# Altium schematic sheet H.SchDoc
size A; SheetNumber: 1; SheetTotal: 7
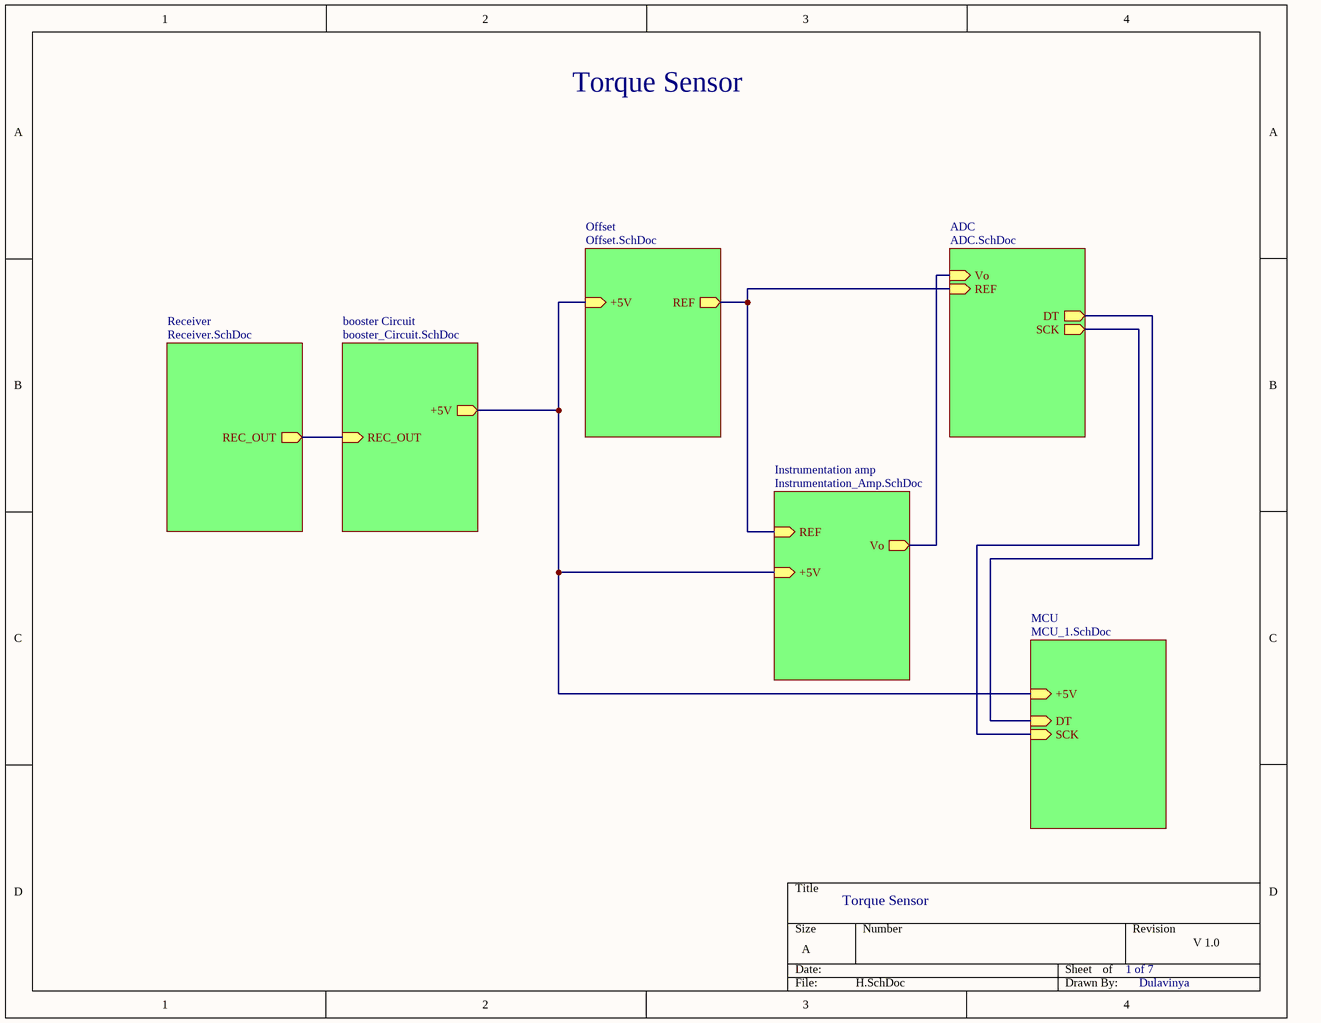
[diagram p0: H.SchDoc]

## Sub-sheets
ADC = ADC.SchDoc: Vo (in), REF (in), DT (out), SCK (out)
booster Circuit = booster_Circuit.SchDoc: +5V (out), REC_OUT (in)
Instrumentation amp = Instrumentation_Amp.SchDoc: REF (in), Vo (out), +5V (in)
MCU = MCU_1.SchDoc: +5V (in), DT (in), SCK (in)
Offset = Offset.SchDoc: REF (out), +5V (in)
Receiver = Receiver.SchDoc: REC_OUT (out)

## Nets
(unnamed): sheet MCU/+5V, sheet Instrumentation amp/+5V, sheet booster Circuit/+5V, sheet Offset/+5V
(unnamed): sheet MCU/DT, sheet ADC/DT
(unnamed): sheet MCU/SCK, sheet ADC/SCK
(unnamed): sheet Instrumentation amp/REF, sheet ADC/REF, sheet Offset/REF
(unnamed): sheet Instrumentation amp/Vo, sheet ADC/Vo
(unnamed): sheet booster Circuit/REC_OUT, sheet Receiver/REC_OUT

## Notes on the sheet
- Torque Sensor
- 1 of 7
- V 1.0
- Dulavinya